# EAGLE design EOPTO01 (EAGLE 7.2.0)
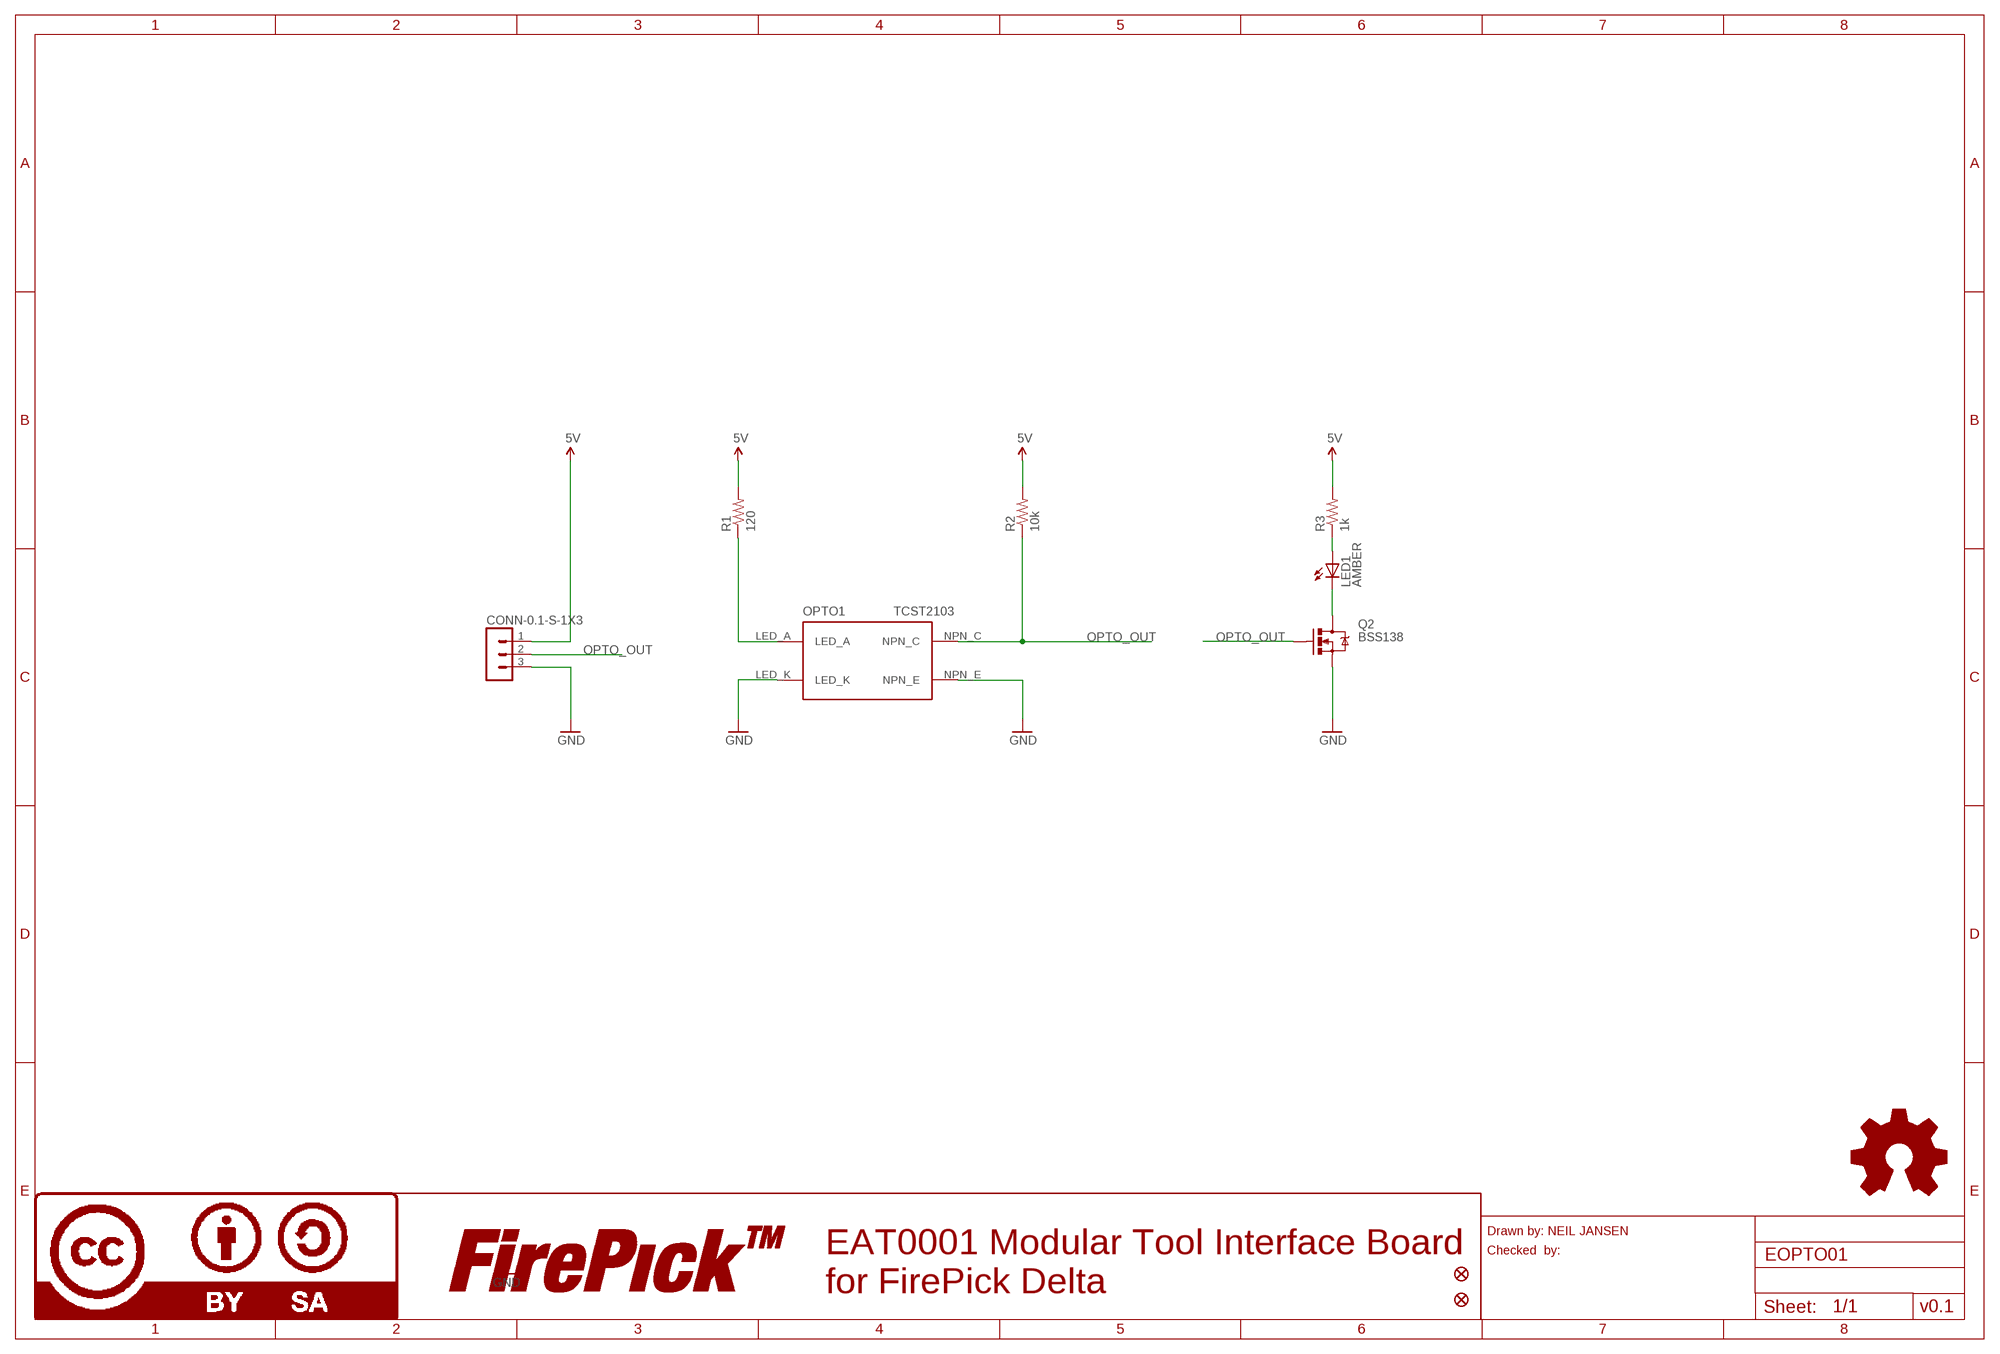
[diagram p0: schematic, sheet 1]

## Parts
FID3  FIDUCIAL1X2  [FIDUCIAL-1X2]
FID4  FIDUCIAL1X2  [FIDUCIAL-1X2]
J1  CONN-0.1-S-1X3  MA03-1  [MA03-1]
LED1  AMBER  LED1206  [LED-1206]
LOGO4  LOGO-FIREPICKMEDIUM  [LOGO-FIREPICK-MEDIUM]
LOGO5  LOGO-OSHWSMALL  [LOGO-OSHW-SMALL]
LOGO6  LOGO-CC-BY-SAMEDIUM  [LOGO-CC-BY-SA-MEDIUM]
OPTO1  TCST2103  [TCST2013]
Q2  BSS138  MOSFET-NCHANNELBSS138  [SOT23]
R1  120  RESISTOR0805-RES  [0805]
R2  10k  RESISTOR0805-RES  [0805]
R3  1k  RESISTOR0805-RES  [0805]

## Nets
5V: J1.1 R1.2 R2.2 R3.2
GND: J1.3 OPTO1.LED_K OPTO1.NPN_E Q2.2(S)
N$2: LED1.C Q2.3(D)
N$3: LED1.A R3.1
N$4: OPTO1.LED_A R1.1
OPTO_OUT: J1.2 OPTO1.NPN_C Q2.1(G) R2.1

## Notes on the sheet
- Drawn by: NEIL JANSEN
- Checked  by:
- EAT0001 Modular Tool Interface Board
  for FirePick Delta
- v0.1

## Library data of the parts
FID3 FID4 = SparkFun-Aesthetics:FIDUCIAL: Fiducial Alignment Points Various fiducial points for machine vision alignment.; BOM: EXCLUDE
J1 = !con-lstb:MA03-1: PIN HEADER; PARTNO: CONN-0.1-RA-1X3
LED1 = SparkFun-LED:LED: LEDs Standard schematic elements and footprints for 5mm, 3mm, 1206, and 0603 sized LEDs. 5mm - Spark Fun Electronics SKU : COM-00529 (and others); PARTNO: LTST-C150AKT
LOGO4 = FirePick:LOGO-FIREPICK; BOM: EXCLUDE
LOGO5 = FirePick:LOGO-OSHW; BOM: EXCLUDE
LOGO6 = FirePick:LOGO-CC-BY-SA; BOM: EXCLUDE
OPTO1 = FirePick:TCST2103; PARTNO: TCST2103
Q2 = SparkFun-DiscreteSemi:MOSFET-NCHANNEL: Common NMOSFET Parts MFG P/N Store ID Prod ID FDD8780 TRANS-09984 SI7820DN TRANS-11055 FDS6630A IC-08089 2N7002PW TRANS-11151 FQP30N06L COM-10213 TRANS-10060 BSS123LT1G TRANS-08345 BSS138 TRANS-00830 BS170 2N7000; PARTNO: BSS138; PROD_ID: TRANS-00830
R1 = SparkFun-Resistors:RESISTOR: Resistor Basic schematic elements and footprints for 0603, 1206, and PTH resistors.; PARTNO: RC0805FR-07120RL
R2 = SparkFun-Resistors:RESISTOR: Resistor Basic schematic elements and footprints for 0603, 1206, and PTH resistors.; PARTNO: RC0805FR-0710KL
R3 = SparkFun-Resistors:RESISTOR: Resistor Basic schematic elements and footprints for 0603, 1206, and PTH resistors.; PARTNO: RC0805FR-071KL

## Board
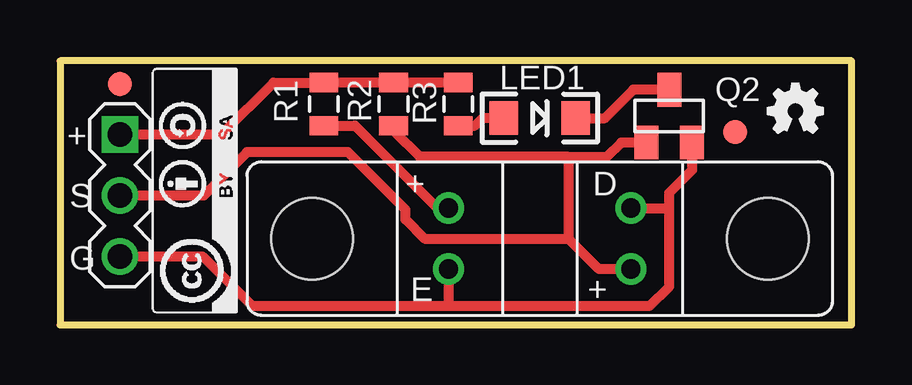
[diagram p1: board, top side]
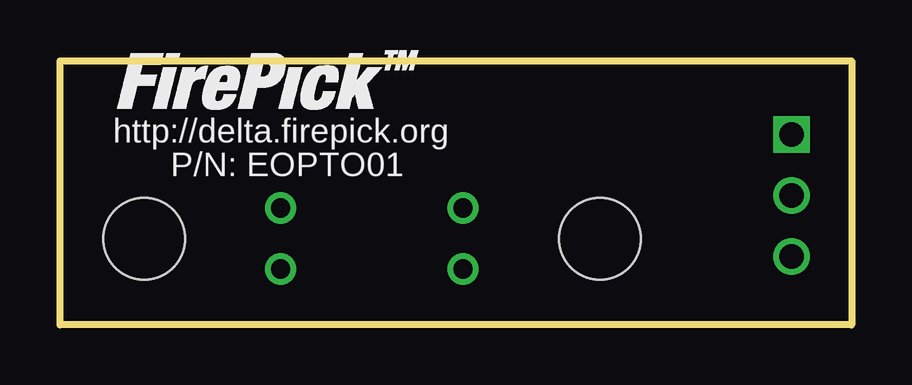
[diagram p2: board, bottom side, seen from below]

Size 33 x 11 mm. Coordinates in mm from the lower left corner, seen from the top.
Outline: 33,11 0,11 0,0 33,0 33,11
Copper layers (1*16): Top 0.035mm / dielectric 1.5mm / Bottom 0.035mm
Design rules "SeeedStudio_2layer_DRU_no_angle_20140221": minimum track width 6mil, minimum drill 12mil, track to track 6mil, track to pad 6mil, pad to pad 6mil, via to via 6mil, smd to smd 0mil, copper to edge 10mil, drill to drill 10mil, minimum pad ring 10mil, minimum via ring 6mil, stop-mask expansion 2mil, vias tented up to drill 100mil, thermal gap 10mil

### Footprints (pad centres in the part's own frame; a part is rotated, then mirrored left to right if it is on the bottom)
FIDUCIAL-1X2 = smd 1 x 1: 1 0,0
MA03-1 = drill 1.016 square: 1 -2.54,0 | drill 1.016: 2 0,0; 3 2.54,0
LED-1206 = smd 1.2 x 1.4: A -1.5,0; C 1.5,0
TCST2013 = drill 0.8: LED_A -3.8,1.27; LED_K -3.8,-1.27; NPN_C 3.8,-1.27; NPN_E 3.8,1.27 | hole 3.4: -9.5,0; 9.5,0
SOT23 = smd 1 x 1.4: 1 -0.95,-1.1; 2 0.95,-1.1; 3 0,1.1
0805 = smd 0.8 x 1.2: 1 -0.9,0; 2 0.9,0

### Placement (x,y rotation side)
FID3  2.5,10.04 0 top
FID4  28.15,8.04 0 top
J1  2.5,5.4 270 top
LED1  20,8.62 0 top
LOGO4  30.61,8.99 0 bottom
LOGO5  29.42,7.78 0 top
LOGO6  7.4,0.49 90 top
OPTO1  20,3.6 0 top
Q2  25.4,8.7 0 top
R1  11,9.2 90 top
R2  13.9,9.2 90 top
R3  16.6,9.2 90 top

### Tracks (layer width: path | path; a pad name or v marks a point on that pad's centre or on a via)
5V
  Top 0.406: J1.1 6.74,7.94 8.9,10.1 R1.2 R2.2 R3.2
GND
  Top 0.406: 16.2,0.8 8,0.8 5.94,2.86 J1.3 | 16.2,0.8 24.6,0.8 25.4,1.6 25.4,4.8 | 25.4,4.8 25.4,5.5 26.35,6.45 Q2.2 | OPTO1.LED_K 16.2,0.8 | OPTO1.NPN_E 25.33,4.87 25.4,4.8
N$2
  Top 0.406: Q2.3 23.9,9.8 22.72,8.62 LED1.C
N$3
  Top 0.406: LED1.A 17.62,8.62 17.3,8.3 R3.1
N$4
  Top 0.406: R1.1 12.3,8.3 15.73,4.87 OPTO1.LED_A
OPTO_OUT
  Top 0.406: 21.1,3.6 15.2,3.6 14.4,4.4 14.4,4.8 12,7.2 7.8,7.2 6,5.4 J1.2 | 21.1,3.6 21.2,3.6 22.47,2.33 OPTO1.NPN_C | 24.45,7.65 Q2.1 23.4,7.6 22.8,7 21.2,7 | 21.2,7 21.2,3.7 21.1,3.6 | 21.2,7 15,7 13.9,8.1 R2.1

### Text on the board
tPlace: + | D | E | +
bPlace: http://delta.firepick.org | P/N: EOPTO01
tNames: + | S | G